# Altium schematic sheet 串口板第6版.SchDoc
size A4
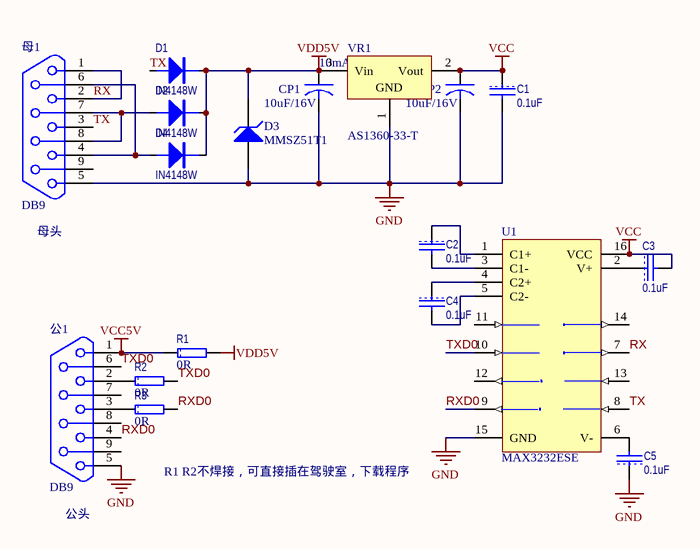
[diagram p0: 串口板第6版.SchDoc]

## Parts
C1  0.1uF  [1608[0603]]
C2  0.1uF  [1608[0603]]
C3  0.1uF  [1608[0603]]
C4  0.1uF  [1608[0603]]
C5  0.1uF  [1608[0603]]
CP1  10uF/16V  [3216[1206]]
CP2  10uF/16V  [3216[1206]]
D1  IN4148W  [SOD123]
D2  IN4148W  [SOD123]
D3  MMSZ51T1  [425]
D4  IN4148W  [SOD123]
R1  0R  [0603RT]
R2  0R  [0603RT]
R3  0R  [0603RT]
U1  MAX3232ESE  [NSO16_N]
VR1  AS1360-33-T  [SOT23_N]
母1  DB9  [DB9BSM]
公1  DB9  [DB9BSM]

## Nets
GND: C1.2 C5.1 CP1.2 CP2.2 D3.2(A) U1.15(GND) VR1.1(GND) 母1.5 公1.5
VCC: C1.1 C3.2 CP2.1 U1.16(VCC) VR1.2(Vout)
VCC5V: R1.1 公1.1
VDD5V: CP1.1 D1.2 D2.2 D3.1(K) D4.2 R1.2 VR1.3(Vin)
RX: U1.7(T2OUT) 母1.1 母1.2
RXD0: R3.2 U1.9(R2OUT) 公1.4
TX: D1.1 U1.8(R2IN) 母1.3
TXD0: R2.2 U1.10(T2IN) 公1.6
NetC2_1: C2.1 U1.1(C1+)
NetC2_2: C2.2 U1.3(C1-)
NetC3_1: C3.1 U1.2(V+)
NetC4_1: C4.1 U1.4(C2+)
NetC4_2: C4.2 U1.5(C2-)
NetC5_2: C5.2 U1.6(V-)
NetD2_1: D2.1 母1.7 母1.8
NetD4_1: D4.1 母1.4 母1.6
NetR2_1: R2.1 公1.2
NetR3_1: R3.1 公1.3

Not connected (* = marked no-connect by the designer): U1 11(T1IN) 12(R1OUT) 13(R1IN) 14(T1OUT); 母1 9; 公1 7 8 9

## Notes on the sheet
- (near VR1) 10mA
- (near 母1) 母头
- (near 公1) 公头
- R1 R2不焊接，可直接插在驾驶室，下载程序

## Library data of the parts
C1-C5 = CAP: Capacitor
CP1 CP2 = CAPACITOR: Tantalum Capacitor; Compy: TAJ; name: TAJ-A-106-M-010-R
D1 D2 D4 = DIODE
D3 = MMSZ51T1: Surface Mount Silicon Zener Diode; Published: 29-Sep-2000; LatestRevisionDate: 19-Mar-2004; LatestRevisionNote: Silkscreen size reduced; PCB footprint pad transposed.; PackageVersion: 1988; PackageReference: 425; Publisher: Altium Limited; PackageDescription: SOD-123; 2 Leads; Body 2.7 x 1.6 mm, (LxW); ComponentLink1Description: Manufacturer Link; ComponentLink1URL: http://www.onsemi.com/site/products/landing?taxonomyID=194; ComponentLink2Description: Datasheet; ComponentLink2URL: http://www.onsemi.com/pub/Collateral/MMSZ2V4T1-D.PDF
R1-R3 = RES: Manufacturer: vishay; Model: RT0603DRD7D0RL; Value: 0R; Type: 无铅电阻
U1 = MAX3232ESE: 3.0V TO 5.5V, Low-Power, up to 1Mbps, True RS-232 Transceiver Using Four 0.1µF External Capacitor; Published: 16-Jan-2001; LatestRevisionDate: 13-Apr-2006; LatestRevisionNote: IPC-7351 Footprint Added.; DatasheetVersion: Mar-1999; PackageReference: NSO16; Publisher: Altium Limited; PackageDescription: 16-Pin Small Outline Integrated Circuit 1.27 mm Pitch; Code_JEDEC: MS-012-AC; Code_IPC: SOIC127P600-16; ComponentLink1Description: Manufacturer Link; ComponentLink1URL: http://www.maxim-ic.com/; ComponentLink2Description: Datasheet; ComponentLink2URL: http://pdfserv.maxim-ic.com/en/ds/MAX3222-MAX3241.pdf
VR1 = Volt Reg: Voltage Regulator; 公司: AMS; Published: 24-Mar-1999; LatestRevisionDate: 29-May-2009; LatestRevisionNote: IPC-7351 Footprint Added.; PackageReference: D2PAK; Publisher: Altium Limited; PackageDescription: 3-Pin Transistor Outline Package 2.54 mm Pitch, 15.1 mm Lead Span